# Altium schematic sheet nrf52840.SchDoc
size 1651 x 1651 mm
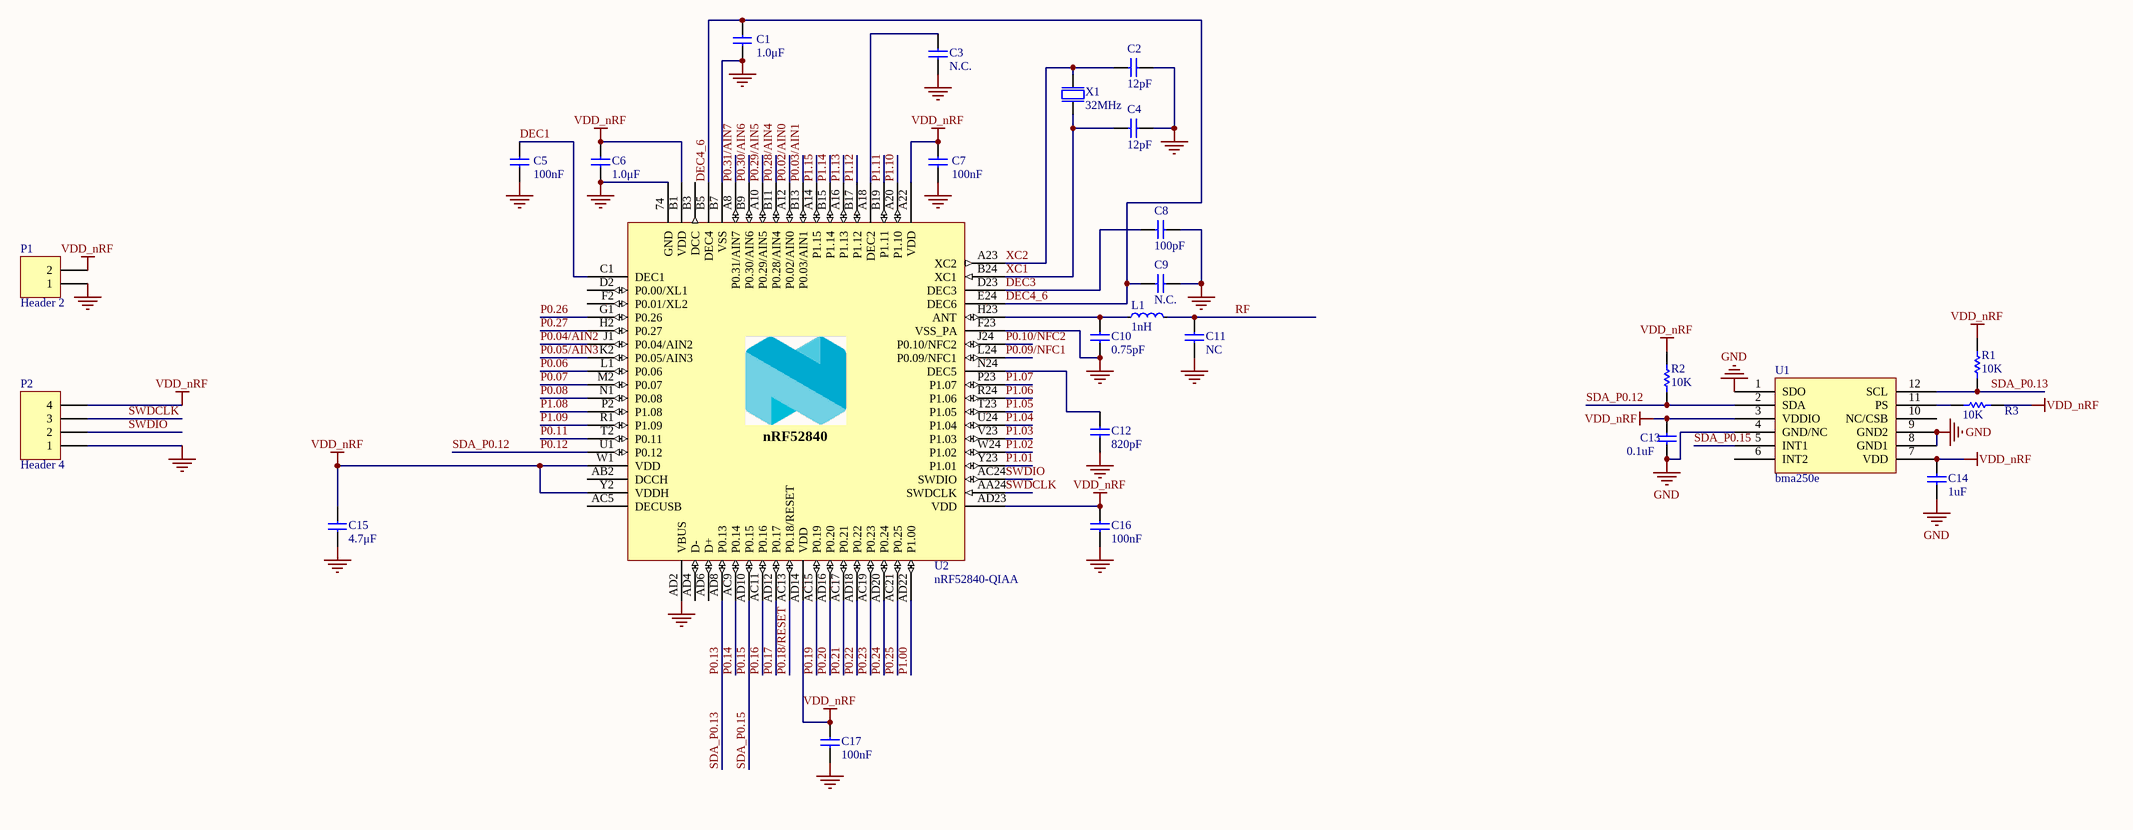
[diagram p0: nrf52840.SchDoc]

## Parts
C1  1.0μF  [0402-A]
C2  12pF  [0402-A]
C3  N.C.  [0402-A]
C4  12pF  [0402-A]
C5  100nF  [0402-A]
C6  1.0μF  [0402-A]
C7  100nF  [0402-A]
C8  100pF  [0402-A]
C9  N.C.  [0402-A]
C10  0.75pF  [0402-A]
C11  NC  [0402-A]
C12  820pF  [0402-A]
C13  0.1uF  [0402-A]
C14  1uF  [0402-A]
C15  4.7μF  [0603-1]
C16  100nF  [0402-a]
C17  100nF  [0402-a]
L1  1nH  [0402-A]
P1  Header 2  [HDR1_2_1.25]
P2  Header 4  [HDR1X4]
R1  10K  [0402-A]
R2  10K  [0402-A]
R3  10K  [0402-A]
U1  bma250e  [bma250e]
U2  nRF52840-QIAA  [AQFN50P700X700X85_HS-74N]
X1  32MHz  [SMD3225]

## Nets
GND: C1.1 C2.2 C3.2 C4.2 C5.2 C6.2 C7.2 C8.2 C9.1 C10.1 C11.1 C12.2 C13.2 C14.1 C15.2 C16.2 C17.2 P1.1 P2.1 U1.1(SDO) U1.4(GND/NC) U1.8(GND1) U1.9(GND2) U2.74(GND) U2.AD2(VBUS) U2.B7(VSS) U2.F23(VSS_PA) X1.2(GND) X1.4(GND)
VDD_nRF: C6.1 C7.1 C13.1 C14.2 C15.1 C16.1 C17.1 P1.2 P2.4 R1.2 R2.2 R3.1 U1.3(VDDIO) U1.7(VDD) U2.A22(VDD) U2.AD14(VDD) U2.AD23(VDD) U2.B1(VDD) U2.W1(VDD) U2.Y2(VDDH)
DEC1: C5.1 U2.C1(DEC1)
DEC3: C8.1 U2.D23(DEC3)
DEC4_6: C1.2 C9.2 U2.B5(DEC4) U2.E24(DEC6)
P0.02/AIN0: U2.A12(P0.02/AIN0)
P0.03/AIN1: U2.B13(P0.03/AIN1)
P0.04/AIN2: U2.J1(P0.04/AIN2)
P0.05/AIN3: U2.K2(P0.05/AIN3)
P0.06: U2.L1(P0.06)
P0.07: U2.M2(P0.07)
P0.08: U2.N1(P0.08)
P0.09/NFC1: U2.L24(P0.09/NFC1)
P0.10/NFC2: U2.J24(P0.10/NFC2)
P0.11: U2.T2(P0.11)
P0.12: R2.1 U1.2(SDA) U2.U1(P0.12)  [also labelled SDA_P0.12]
P0.13: R1.1 U1.12(SCL) U2.AD8(P0.13)  [also labelled SDA_P0.13]
P0.14: U2.AC9(P0.14)
P0.15: U1.5(INT1) U2.AD10(P0.15)  [also labelled SDA_P0.15]
P0.16: U2.AC11(P0.16)
P0.17: U2.AD12(P0.17)
P0.18/RESET: U2.AC13(P0.18/RESET)
P0.19: U2.AC15(P0.19)
P0.20: U2.AD16(P0.20)
P0.21: U2.AC17(P0.21)
P0.22: U2.AD18(P0.22)
P0.23: U2.AC19(P0.23)
P0.24: U2.AD20(P0.24)
P0.25: U2.AC21(P0.25)
P0.26: U2.G1(P0.26)
P0.27: U2.H2(P0.27)
P0.28/AIN4: U2.B11(P0.28/AIN4)
P0.29/AIN5: U2.A10(P0.29/AIN5)
P0.30/AIN6: U2.B9(P0.30/AIN6)
P0.31/AIN7: U2.A8(P0.31/AIN7)
P1.00: U2.AD22(P1.00)
P1.01: U2.Y23(P1.01)
P1.02: U2.W24(P1.02)
P1.03: U2.V23(P1.03)
P1.04: U2.U24(P1.04)
P1.05: U2.T23(P1.05)
P1.06: U2.R24(P1.06)
P1.07: U2.P23(P1.07)
P1.08: U2.P2(P1.08)
P1.09: U2.R1(P1.09)
P1.10: U2.A20(P1.10)
P1.11: U2.B19(P1.11)
P1.12: U2.B17(P1.12)
P1.13: U2.A16(P1.13)
P1.14: U2.B15(P1.14)
P1.15: U2.A14(P1.15)
RF: C11.2 L1.2
SWDCLK: P2.3 U2.AA24(SWDCLK)
SWDIO: P2.2 U2.AC24(SWDIO)
XC1: C4.1 U2.B24(XC1) X1.1(inp)
XC2: C2.1 U2.A23(XC2) X1.3(out)
NetC3_1: C3.1 U2.A18(DEC2)
NetC10_2: C10.2 L1.1 U2.H23(ANT)
NetC12_1: C12.1 U2.N24(DEC5)
NetR3_2: R3.2 U1.11(PS)

Not connected (* = marked no-connect by the designer): U1 6(INT2) 10(NC/CSB); U2 AB2(DCCH) AC5(DECUSB) AD4(D-) AD6(D+) B3(DCC) D2(P0.00/XL1) F2(P0.01/XL2)

## Notes on the sheet
- (in symbol nRF52840-QIAAD0) nRF52840

## Library data of the parts
C1 C6 = C0603-1|: Capacitor, X7R, ±10%; Part Number: C0603-1μ0; Note: 16V; LatestRevisionDate: 2013-06-05; Pin Count: 2; Publisher: Nordic Semiconductor; Published: 2009-05-08; Value: 1.0μF; Footprint Doc: 0603
C2 C4 = C0402-12p: Capacitor, NP0, ±2%; Note: 50V; Part Number: C0402-12p; LatestRevisionDate: 2011-05-11; Pin Count: 2; Publisher: Nordic Semiconductor; Published: 2009-05-08; Value: 12pF; Footprint Doc: 0402
C3 C9 = C0402-N.C.: Not mounted; Assembly: Not mounted; Part Number: C0402-N.C.; LatestRevisionDate: 2009-05-08; Pin Count: 2; Publisher: Nordic Semiconductor; Published: 2009-05-08; Value: N.C.; Footprint Doc: 0402
C5 C7 C16 C17 = C0402-100n: Capacitor, X7R, ±10%; Note: 16V; Part Number: C0402-100n; LatestRevisionDate: 2009-11-23; Pin Count: 2; Publisher: Nordic Semiconductor; Published: 2009-05-08; Value: 100nF; Footprint Doc: 0402
C8 = C0402-100p: Capacitor, NP0, ±5%; Note: 50V; Part Number: C0402-100p; LatestRevisionDate: 2009-05-08; Pin Count: 2; Publisher: Nordic Semiconductor; Published: 2009-05-08; Value: 100pF; Footprint Doc: 0402
C10 = C0402-0.8p: Capacitor, NP0, ±10%; Note: 50V; Part Number: C0402-0.8p; LatestRevisionDate: 2012-11-21; Pin Count: 2; Publisher: Nordic Semiconductor; Published: 2009-05-08; Value: 0.75pF; Footprint Doc: 0402
C11 = C0402-0.5p: Capacitor, NP0, ±10%; Note: 50V; Part Number: C0402-0.5p; LatestRevisionDate: 2017-02-23; Pin Count: 2; Publisher: Nordic Semiconductor; Published: 2009-05-08; Value: NC; Footprint Doc: 0402
C12 = C0402-820p: Capacitor, NP0, ±5%; Note: 50V; Part Number: C0402-820p; LatestRevisionDate: 2009-05-08; Pin Count: 2; Publisher: Nordic Semiconductor; Published: 2009-05-08; Value: 820pF; Footprint Doc: 0402
C13 C14 = C0402-0.5p: Capacitor, NP0, ±10%; Value: 0.5pF; Note: 50V; Part Number: C0402-0.5p; LatestRevisionDate: 2017-02-23; Pin Count: 2; Publisher: Nordic Semiconductor; Published: 2009-05-08; Footprint Doc: 0402
C15 = C0603-4μ7-6.3V-X: Capacitor, X7R, ±10%; Part Number: C0603-4μ7-6.3V-X7R; Note: 6.3V; LatestRevisionDate: 2015-06-10; Pin Count: 2; Publisher: Nordic Semiconductor; Published: 2015-06-10; Value: 4.7μF; Footprint Doc: 0603
L1 = L0402-4n7: High frequency chip inductor ±5%; Part Number: L0402-4n7; LatestRevisionDate: 2012-09-19; Pin Count: 2; Publisher: Nordic Semiconductor; Published: 2009-05-08; Value: 1nH; Note: High frequency chip inductor ±5%; Footprint Doc: 0402
P1 = Header 2: Header, 2-Pin; LatestRevisionDate: 17-Jul-2002; LatestRevisionNote: Re-released for DXP Platform.; Publisher: Altium Limited
P2 = Header 4: Header, 4-Pin; LatestRevisionDate: 17-Jul-2002; LatestRevisionNote: Re-released for DXP Platform.; Publisher: Altium Limited
R1-R3 = Res1: Resistor; Published: 8-Jun-2000; LatestRevisionDate: 17-Jul-2002; LatestRevisionNote: Re-released for DXP Platform.; PackageReference: AXIAL-0.3; Publisher: Altium Limited; PackageDescription: Axial Device, Thru-Hole; 2 Leads; 0.3 in Pin Spacing
U2 = nRF52840-QIAAD0: Multi-protocol Bluetooth Low Energy, IEEE 802.15.4, ANT and 2.4GHz proprietary system-on-chip; Manufacturer: Nordic Semiconductor; Part Number: nRF52840-QIAAD0; LatestRevisionDate: 2018-12-04; Pin Count: 73; Publisher: Nordic Semiconductor; Published: 2018-12-04; Value: nRF52840-QIAA; Note: *; Footprint Doc: AQFN-73; Manufacturer Part Number: nRF52840-QIAAD0
X1 = XTAL_SMD2016_32MHz_8pF_General: XTAL SMD 2016, 32MHz, Cl=8pF, Total Tol: ±40ppm; Part Number: XTAL_SMD2016_32MHz_8pF_General; LatestRevisionDate: 2016-08-19; Pin Count: 4; Publisher: Nordic Semiconductor; Published: 2016-08-19; Value: 32MHz; Footprint Doc: XTAL_2016